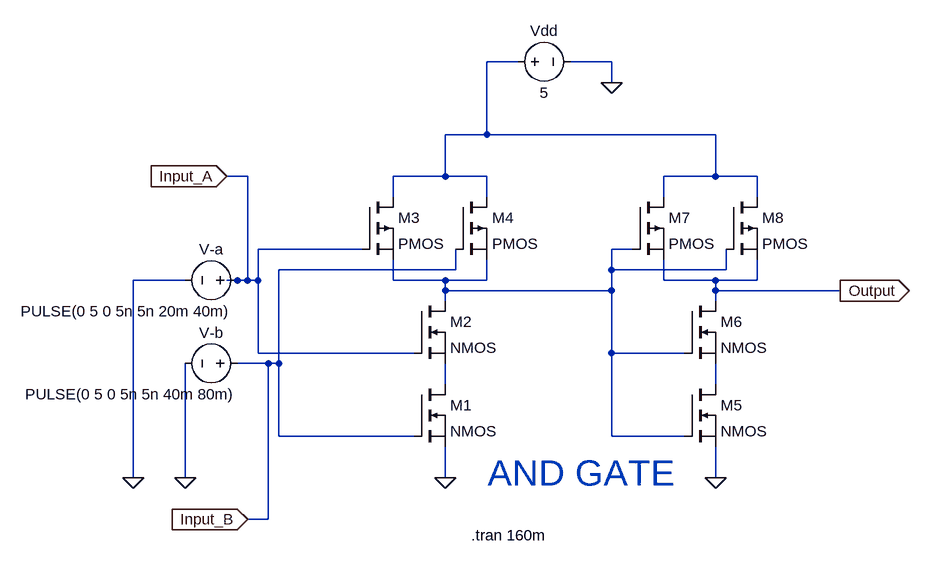
[diagram p0: schematic And_gate.asc]
And_gate.asc, the LTspice schematic file:
Version 4
SHEET 1 980 680
WIRE 336 -304 288 -304
WIRE 480 -304 416 -304
WIRE 480 -272 480 -304
WIRE 288 -192 288 -304
WIRE 288 -192 224 -192
WIRE 640 -192 288 -192
WIRE -80 -128 -112 -128
WIRE 224 -128 224 -192
WIRE 224 -128 144 -128
WIRE 288 -128 224 -128
WIRE 640 -128 640 -192
WIRE 640 -128 560 -128
WIRE 704 -128 640 -128
WIRE 144 -96 144 -128
WIRE 288 -96 288 -128
WIRE 560 -96 560 -128
WIRE 704 -96 704 -128
WIRE 96 -16 -64 -16
WIRE 512 -16 480 -16
WIRE 240 16 240 -16
WIRE 240 16 -32 16
WIRE 480 16 480 -16
WIRE 656 16 656 -16
WIRE 656 16 480 16
WIRE -176 32 -256 32
WIRE -96 32 -112 32
WIRE -80 32 -80 -128
WIRE -80 32 -96 32
WIRE -64 32 -64 -16
WIRE -64 32 -80 32
WIRE 144 32 144 0
WIRE 224 32 144 32
WIRE 288 32 288 0
WIRE 288 32 224 32
WIRE 560 32 560 0
WIRE 640 32 560 32
WIRE 704 32 704 0
WIRE 704 32 640 32
WIRE 224 48 224 32
WIRE 480 48 480 16
WIRE 480 48 224 48
WIRE 640 48 640 32
WIRE 832 48 640 48
WIRE 224 64 224 48
WIRE 640 64 640 48
WIRE -64 144 -64 32
WIRE 176 144 -64 144
WIRE 480 144 480 48
WIRE 592 144 480 144
WIRE -48 160 -96 160
WIRE -32 160 -32 16
WIRE -32 160 -48 160
WIRE 224 192 224 160
WIRE 640 192 640 160
WIRE -32 272 -32 160
WIRE 176 272 -32 272
WIRE 480 272 480 144
WIRE 592 272 480 272
WIRE -256 336 -256 32
WIRE -176 336 -176 160
WIRE 224 336 224 288
WIRE 640 336 640 288
WIRE -48 400 -48 160
WIRE -48 400 -80 400
FLAG 832 48 Output
IOPIN 832 48 Out
FLAG 224 336 0
FLAG 640 336 0
FLAG -176 336 0
FLAG -256 336 0
FLAG 480 -272 0
FLAG -112 -128 Input_A
IOPIN -112 -128 In
FLAG -80 400 Input_B
IOPIN -80 400 In
SYMBOL nmos 176 192 R0
SYMATTR InstName M1
SYMBOL nmos 176 64 R0
SYMATTR InstName M2
SYMBOL pmos 96 -96 R0
SYMATTR InstName M3
SYMBOL pmos 240 -96 R0
SYMATTR InstName M4
SYMBOL nmos 592 192 R0
SYMATTR InstName M5
SYMBOL nmos 592 64 R0
SYMATTR InstName M6
SYMBOL pmos 512 -96 R0
SYMATTR InstName M7
SYMBOL pmos 656 -96 R0
SYMATTR InstName M8
SYMBOL voltage -80 32 R90
WINDOW 0 -32 56 VBottom 2
WINDOW 3 32 187 VTop 2
WINDOW 123 0 0 Left 0
WINDOW 39 0 0 Left 0
SYMATTR InstName V-a
SYMATTR Value PULSE(0 5 0 5n 5n 20m 40m)
SYMBOL voltage -80 160 R90
WINDOW 0 -32 56 VBottom 2
WINDOW 3 32 180 VTop 2
WINDOW 123 0 0 Left 0
WINDOW 39 0 0 Left 0
SYMATTR InstName V-b
SYMATTR Value PULSE(0 5 0 5n 5n 40m 80m)
SYMBOL voltage 320 -304 R270
WINDOW 0 32 56 VTop 2
WINDOW 3 -32 56 VBottom 2
WINDOW 123 0 0 Left 0
WINDOW 39 0 0 Left 0
SYMATTR InstName Vdd
SYMATTR Value 5
TEXT 264 424 Left 2 !.tran 160m
TEXT 432 328 Center 5 ;AND GATE

The netlist it stands for:
* And_gate.asc
M1 N003 Input_B 0 0 NMOS
M2 N002 Input_A N003 N003 NMOS
M3 N001 Input_A N002 N002 PMOS
M4 N001 Input_B N002 N002 PMOS
M5 N004 N002 0 0 NMOS
M6 Output N002 N004 N004 NMOS
M7 N001 N002 Output Output PMOS
M8 N001 N002 Output Output PMOS
V-a Input_A 0 PULSE(0 5 0 5n 5n 20m 40m)
V-b Input_B 0 PULSE(0 5 0 5n 5n 40m 80m)
Vdd N001 0 5
.model NMOS NMOS
.model PMOS PMOS
.lib standard.mos
.tran 160m
* AND GATE
.backanno
.end